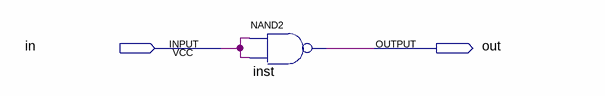
[diagram p0: schematic sheet]
// Quartus schematic Not.bdf as structural Verilog: 1 symbols, 2 pins
module Not (
  input  in,
  output out
);

  nand inst (out, in, in);
endmodule
